# EAGLE design SWITCHER V2 (EAGLE 6.6.0)
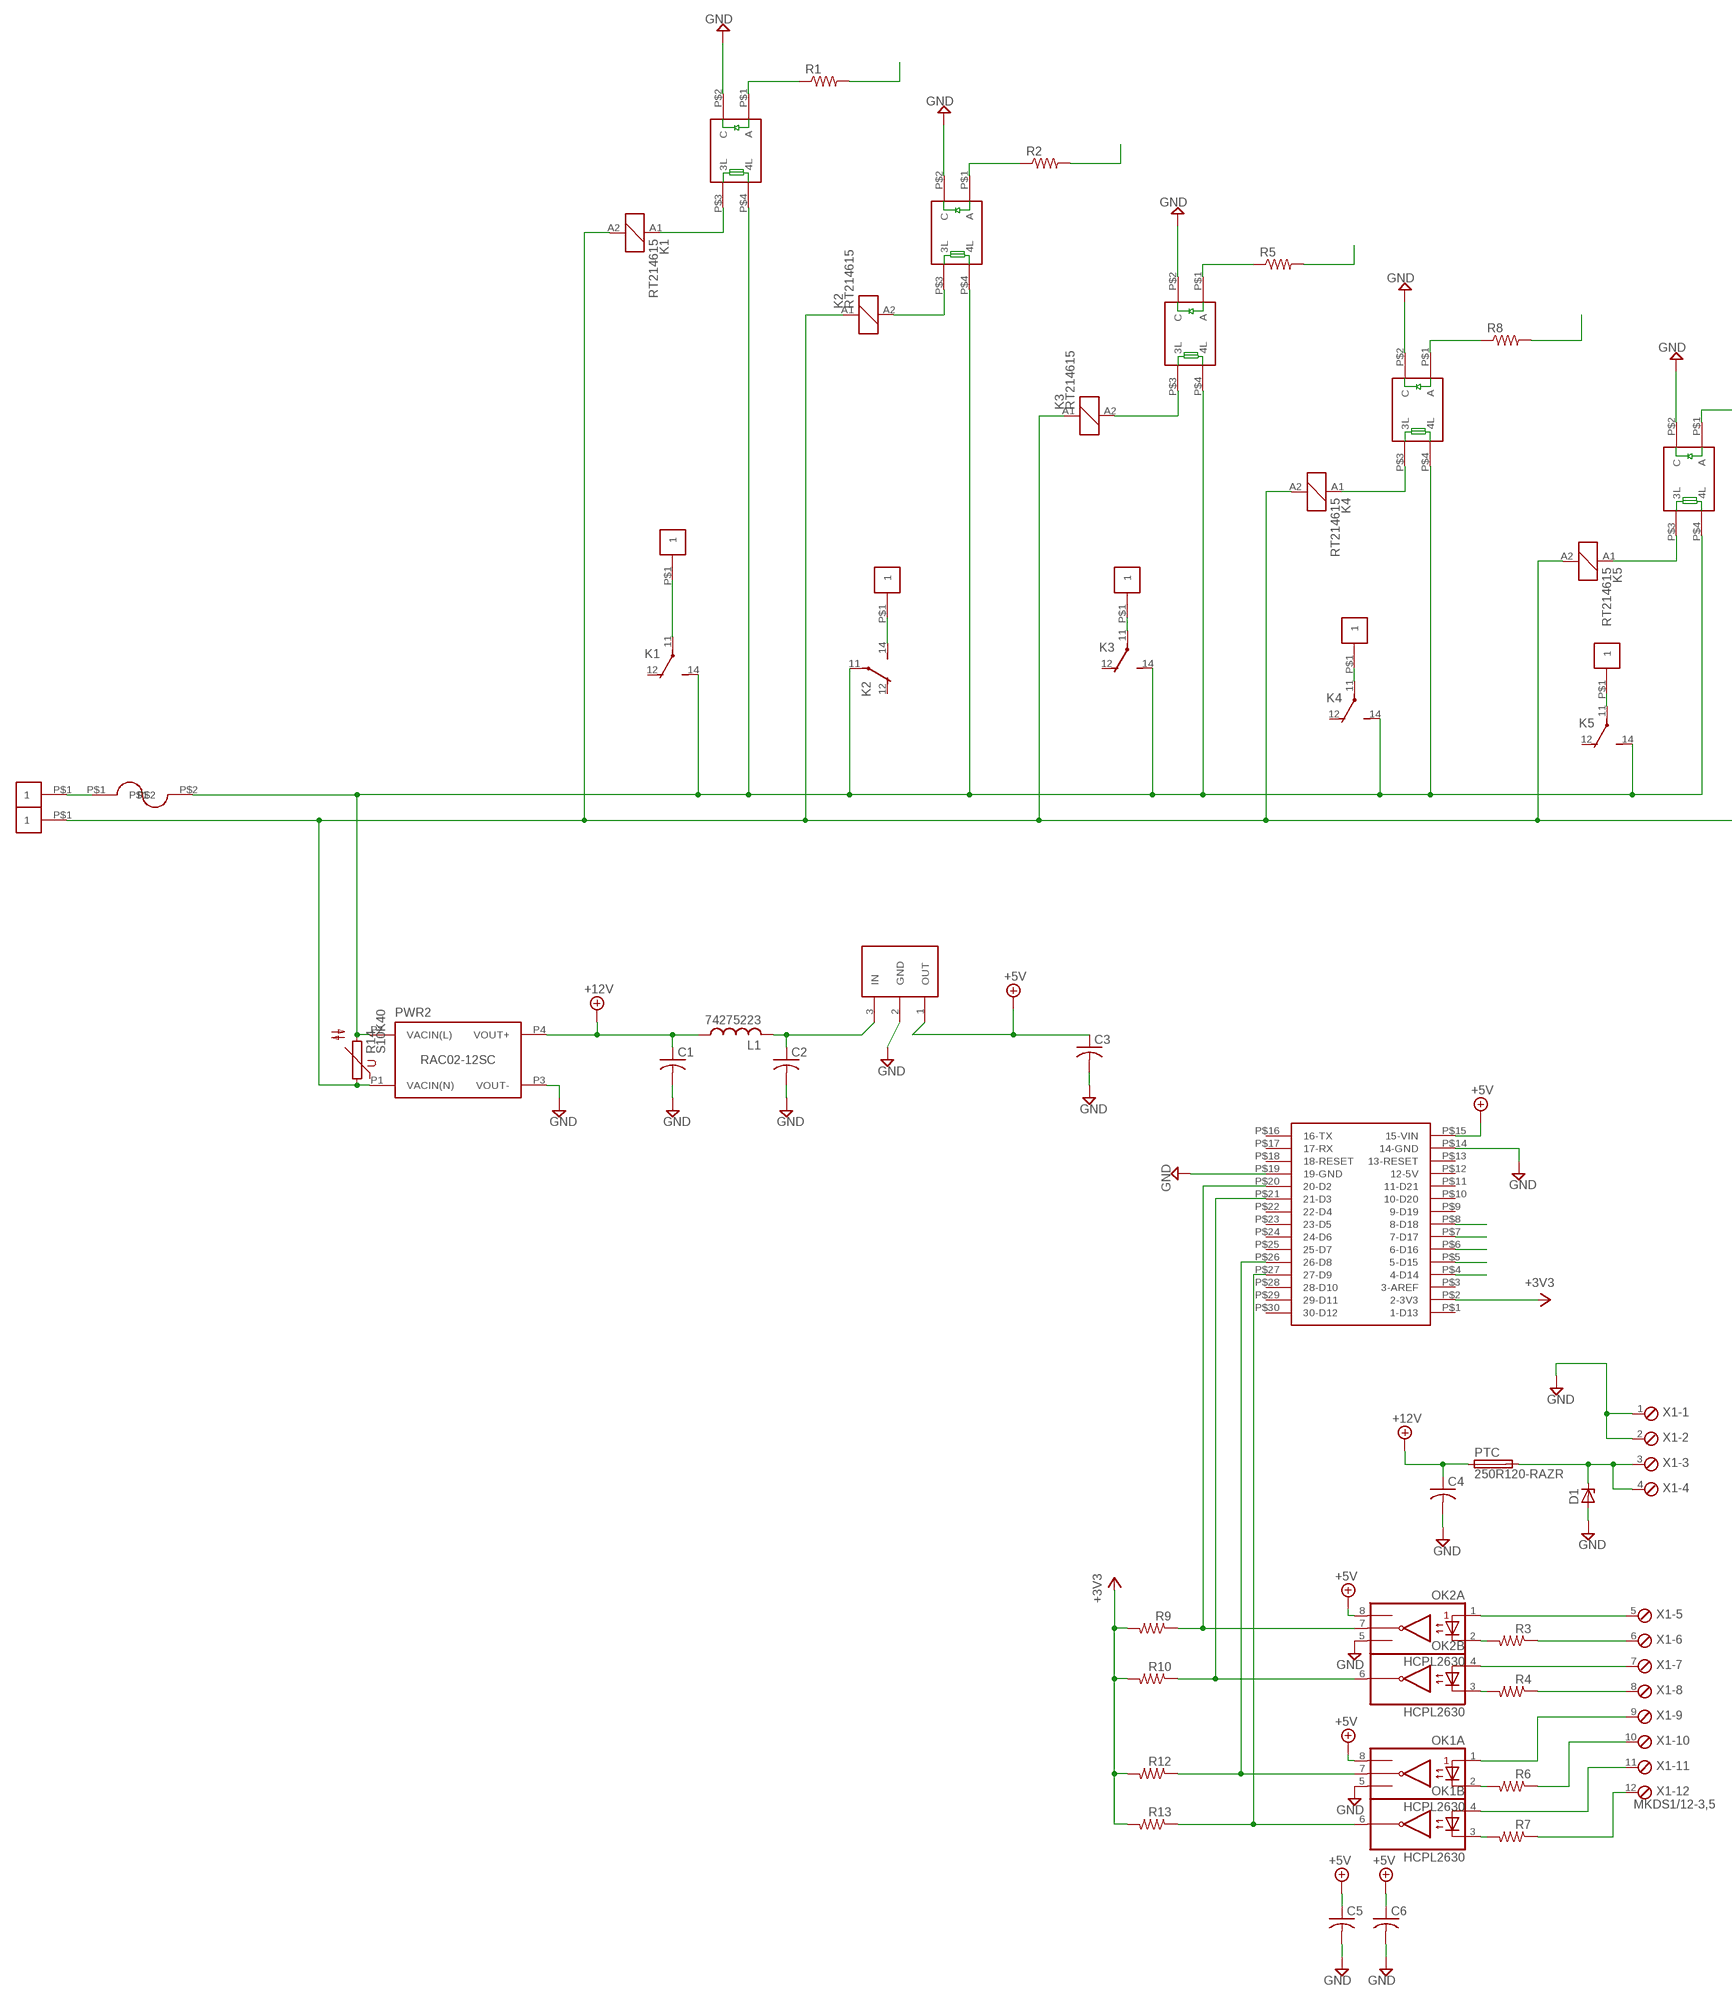
[diagram p0: schematic, sheet 1, part 1 of 2]
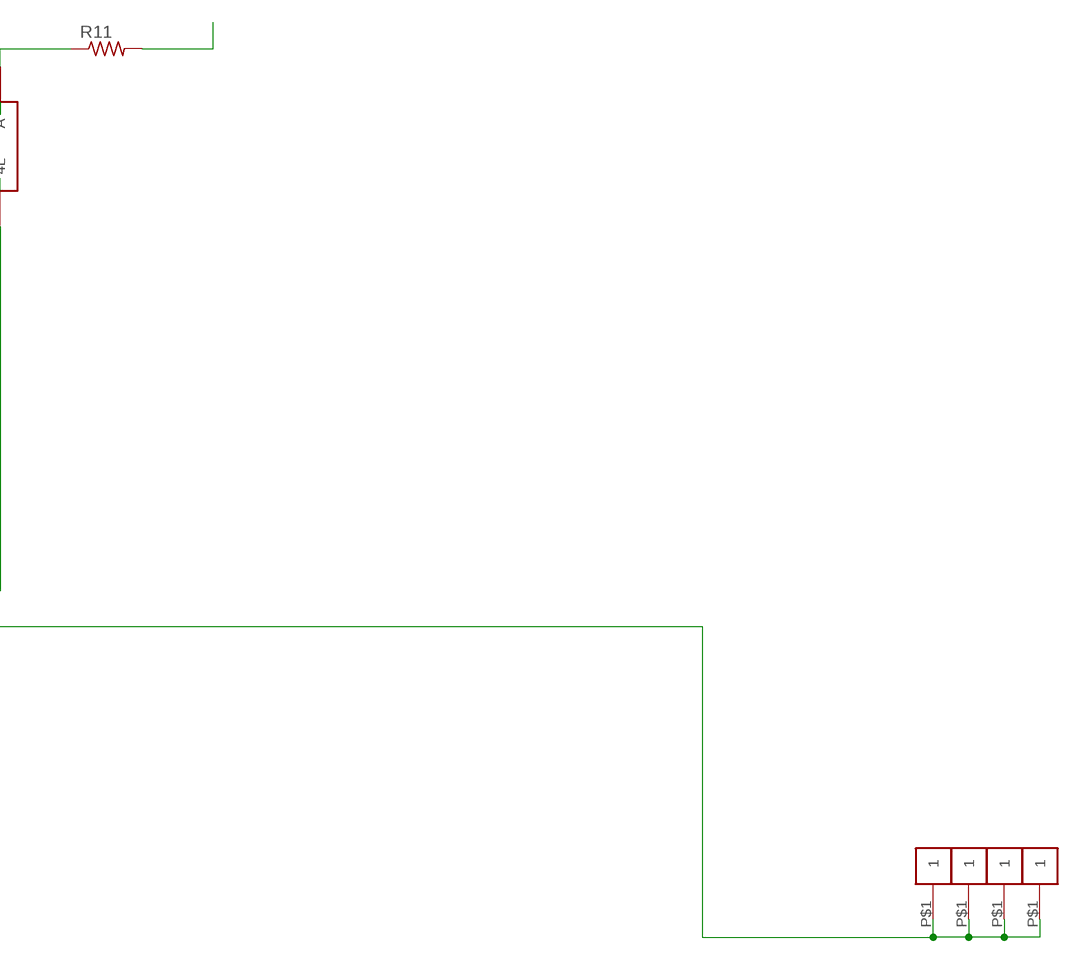
[diagram p1: schematic, sheet 1, part 2 of 2]

## Parts
C1  C-US025-024X044  [C025-024X044]
C2  C-US025-024X044  [C025-024X044]
C3  C-US025-024X044  [C025-024X044]
C4  C-US050-025X075  [C050-025X075]
C5  C-US025-024X044  [C025-024X044]
C6  C-US025-024X044  [C025-024X044]
D1  ZENER-DIODEZD-5  [ZDIO-5]
K1  RT214615  [RT-C/O12A5]
K2  RT214615  [RT-C/O12A5]
K3  RT214615  [RT-C/O12A5]
K4  RT214615  [RT-C/O12A5]
K5  RT214615  [RT-C/O12A5]
L1  74275223  L-US6000-XXX-RC  [6000-XXXX-RC]
OK1  HCPL2630  [DIL08]
OK2  HCPL2630  [DIL08]
PTC  250R120-RAZR  TE5  [TE5]
PWR2  RAC02-12SC  [LOW_PROFILE_POWER_MODULE]
R1  R-US_0204/7  [0204/7]
R2  R-US_0204/7  [0204/7]
R3  R-US_0204/7  [0204/7]
R4  R-US_0204/7  [0204/7]
R5  R-US_0204/7  [0204/7]
R6  R-US_0204/7  [0204/7]
R7  R-US_0204/7  [0204/7]
R8  R-US_0204/7  [0204/7]
R9  R-US_0204/7  [0204/7]
R10  R-US_0204/7  [0204/7]
R11  R-US_0204/7  [0204/7]
R12  R-US_0204/7  [0204/7]
R13  R-US_0204/7  [0204/7]
R14  S10K40  [S10K40]
U$1  CPC1393  [CPC1393G]
U$2  089RIVET  [KEYSTONE33]
U$3  T9-818  [T9-818]
U$4  CPC1393  [CPC1393G]
U$5  CPC1393  [CPC1393G]
U$6  CPC1393  [CPC1393G]
U$7  CPC1393  [CPC1393G]
U$8  TL750  [TO92-OVAL]
U$9  ARDUINO-NANO-EVERY  [ARDUINO-NANO-EVERY]
U$11  089RIVET  [KEYSTONE33]
U$12  089RIVET  [KEYSTONE33]
U$13  089RIVET  [KEYSTONE33]
U$14  089RIVET  [KEYSTONE33]
U$21  089RIVET  [KEYSTONE33]
U$22  089RIVET  [KEYSTONE33]
U$25  089RIVET  [KEYSTONE33]
U$26  089RIVET  [KEYSTONE33]
U$27  089RIVET  [KEYSTONE33]
U$28  089RIVET  [KEYSTONE33]
X1  MKDS1/12-3,5  [12POL350]

## Nets
+3V3: R9.2 R10.2 R12.2 R13.2 U$9.P$2(2-3V3)
+5V: C3.1 C5.1 C6.1 OK1.8(A:VCC) OK2.8(A:VCC) U$8.1(OUT) U$9.P$15(15-VIN)
+12V: C1.1 C4.1 L1.1 PTC.1 PWR2.P4(VOUT+)
BREAKER-L: K1.14(2:S) K2.11(2:P) K3.14(2:S) K4.14(2:S) K5.14(2:S) PWR2.P2(VACIN(L)) R14.2 U$1.P$4(4L) U$3.P$2 U$4.P$4(4L) U$5.P$4(4L) U$6.P$4(4L) U$7.P$4(4L)
D14: R1.2 U$9.P$4(4-D14)
D15: R2.2 U$9.P$5(5-D15)
D16: R11.2 U$9.P$6(6-D16)
D17: R8.2 U$9.P$7(7-D17)
D18: R5.2 U$9.P$8(8-D18)
GND: C1.2 C2.2 C3.2 C4.2 C5.2 C6.2 D1.A OK1.5(A:GND) OK2.5(A:GND) PWR2.P3(VOUT-) U$1.P$2(C) U$4.P$2(C) U$5.P$2(C) U$6.P$2(C) U$7.P$2(C) U$8.2(GND) U$9.P$14(14-GND) U$9.P$19(19-GND) X1.1 X1.2
N$6: U$2.P$1 U$3.P$1
N$12: C2.1 L1.2 U$8.3(IN)
N$13: K2.14(2:S) U$25.P$1
N$14: OK1.3(B:C2) R7.2
N$15: OK2.7(A:VO1) R9.1 U$9.P$20(20-D2)
N$16: K2.A2 U$4.P$3(3L)
N$17: R2.1 U$4.P$1(A)
N$18: OK2.6(B:VO2) R10.1 U$9.P$21(21-D3)
N$20: K1.11(2:P) U$21.P$1
N$21: OK2.1(A:A1) X1.5
N$22: K1.A1 U$1.P$3(3L)
N$23: R1.1 U$1.P$1(A)
N$24: K5.11(2:P) U$28.P$1
N$25: R3.1 X1.6
N$26: K4.11(2:P) U$27.P$1
N$28: OK1.2(A:C1) R6.2
N$32: K3.11(2:P) U$26.P$1
N$33: OK2.3(B:C2) R4.2
N$34: OK2.2(A:C1) R3.2
N$35: OK2.4(B:A2) X1.7
N$36: K3.A2 U$5.P$3(3L)
N$37: R5.1 U$5.P$1(A)
N$38: R4.1 X1.8
N$44: OK1.7(A:VO1) R12.1 U$9.P$26(26-D8)
N$45: D1.C PTC.2 X1.3 X1.4
N$46: OK1.6(B:VO2) R13.1 U$9.P$27(27-D9)
N$47: OK1.1(A:A1) X1.9
N$48: K4.A1 U$6.P$3(3L)
N$49: R8.1 U$6.P$1(A)
N$50: R6.1 X1.10
N$56: OK1.4(B:A2) X1.11
N$57: R7.1 X1.12
N$60: K5.A1 U$7.P$3(3L)
N$61: R11.1 U$7.P$1(A)
N$68: K1.A2 K2.A1 K3.A1 K4.A2 K5.A2 PWR2.P1(VACIN(N)) R14.1 U$11.P$1 U$12.P$1 U$13.P$1 U$14.P$1 U$22.P$1
Unconnected: K1.12(2:O) K2.12(2:O) K3.12(2:O) K4.12(2:O) K5.12(2:O) U$9.P$1(1-D13) U$9.P$3(3-AREF) U$9.P$9(9-D19) U$9.P$10(10-D20) U$9.P$11(11-D21) U$9.P$12(12-5V) U$9.P$13(13-RESET) U$9.P$16(16-TX) U$9.P$17(17-RX) U$9.P$18(18-RESET) U$9.P$22(22-D4) U$9.P$23(23-D5) U$9.P$24(24-D6) U$9.P$25(25-D7) U$9.P$28(28-D10) U$9.P$29(29-D11) U$9.P$30(30-D12)

## Library data of the parts
C1-C6 = rcl:C-US: CAPACITOR, American symbol
D1 = diode:ZENER-DIODE: Z-Diode
K1-K5 = relay:RT?1*: Power PCB Relayl SCHRACK 1 pole 12 / 16 A, DC- or AC-coi Source: http://www.schrack.com/.. 5819.pdf; MF: TYCO ELECTRONICS; MPN: RT214615; OC_FARNELL: unknown; OC_NEWARK: 93B6578
L1 = rcl:L-US: INDUCTOR, American symbol
OK1 OK2 = optocoupler:HCPL2630: HEWLETT PACKARD OPTO COUPLER; MF: AGILENT TECHNOLOGIES; MPN: HCPL-2630-000E; OC_FARNELL: 9994904; OC_NEWARK: 88H7813
PTC = fuse:TE5: FUSE Wickmann; OC_FARNELL: unknown; OC_NEWARK: unknown
PWR2 = recom-powerline-acdc-converters:RAC*SC: RECOM POWERLINE AC/DC-Converter (RAC01-SC and RAC02-SC series) The RAC01-SC and RAC02-SC series are ultra-compact universal input AC/DC power modules for PCB mounting. They feature high efficiency, low standby power, high operating temperature, soft start and short-circuit protection as well as a built-in EMC Class B filter. Output voltages range from 3.3VDC to 24VDC. Datasheet <http://www.recom-power.com/pdf/Powerline-AC-DC/RAC01_02-SC.pdf>; INPUT_RANGE: 80 - 277 (VAC); MAX_CAPACITIVE_LOAD: 180uF; OUTPUT_CURRENT: 167mA; OUTPUT_VOLTAGE: 12v
R1-R13 = rcl:R-US_: RESISTOR, American symbol
R14 = varistor:S10K40: VARISTOR
U$1 U$4-U$7 = NEMA5-15_SWITCH:CPC1393
U$2 U$11-U$14 U$21 U$22 U$25-U$28 = Dean-2019:089RIVET
U$3 = NEMA5-15_SWITCH:T9-818
U$8 = Dean:TL750
U$9 = dean-arduino-nano-every:ARDUINO-NANO-EVERY
X1 = con-phoenix-350 b:MKDS1/12-3,5: MKDS 1/12-3,5 - Order No. 1751345 Pitch: 3,5mm Number of terminals: 12 Rated Voltage: 160V Maximum load current/ cross section: 12A/1.5mm2-AWG16 Housing Interlocking: none Color: Green

## Board
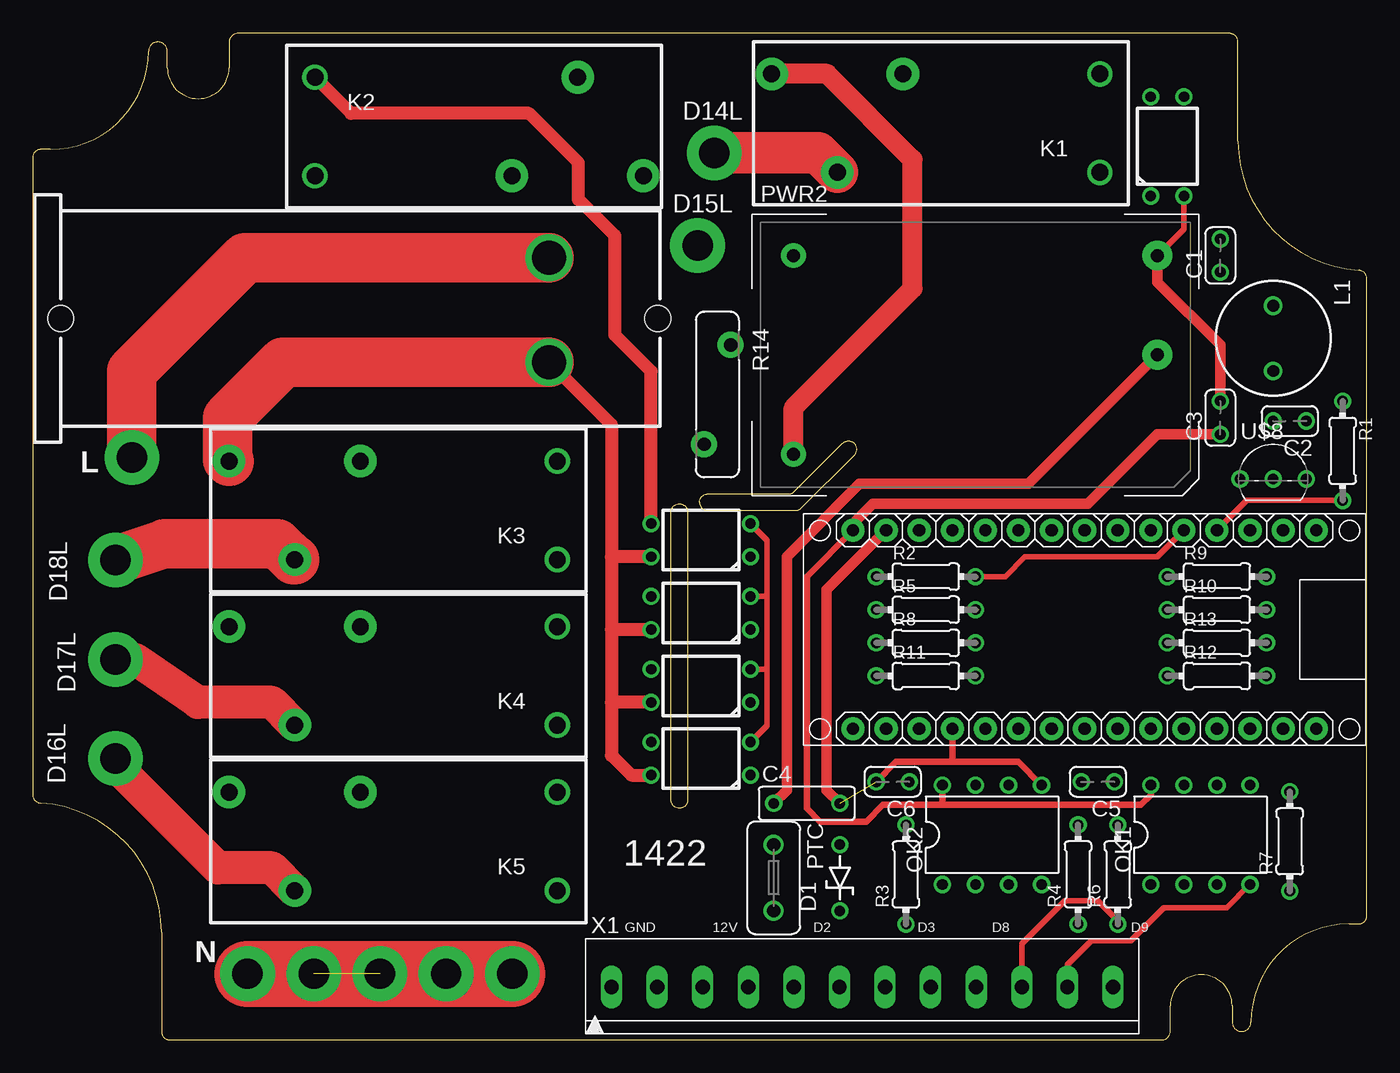
[diagram p2: board, top side]
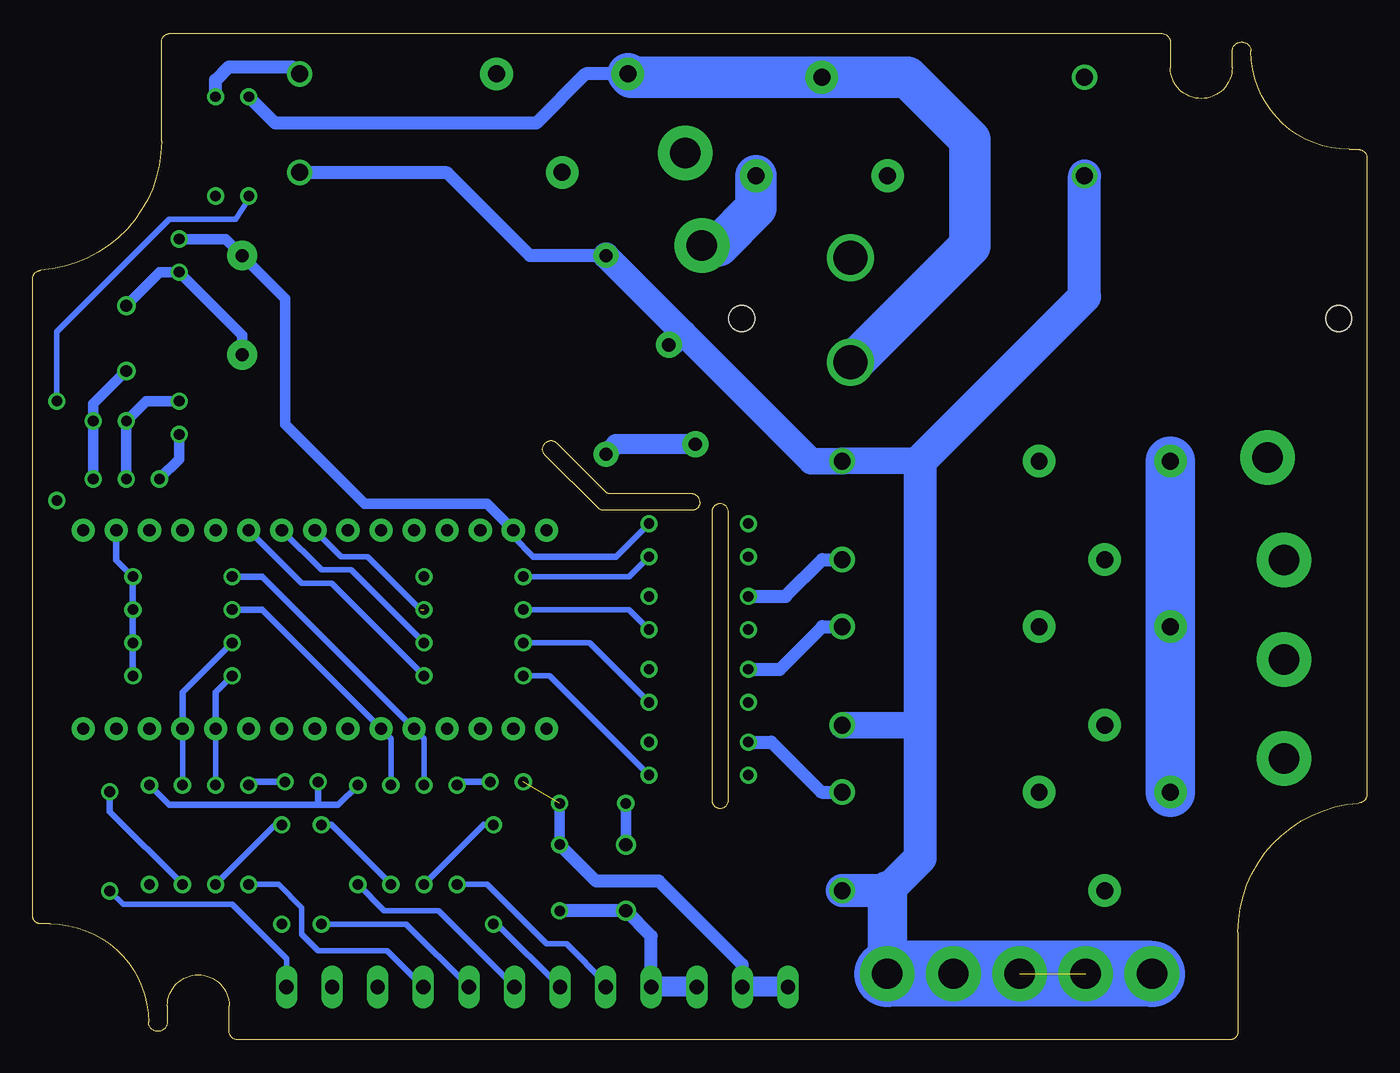
[diagram p3: board, bottom side, seen from below]

Size 102.45 x 77.25 mm. Coordinates in mm from the lower left corner, seen from the top.
Outline: 1.37,68.35 arc90 8.9,75.87 arc-180 10.35,75.87 10.35,74.62 arc180 15.1,74.62 15.1,76.59 arc-90 15.76,77.25 91.89,77.25 arc-90 92.55,76.59 92.55,68.97 arc86 101.83,59.07 arc-86 102.45,58.41 102.45,9.56 arc-90 101.79,8.9 101.07,8.9 arc90 93.55,1.37 arc-180 92.1,1.37 92.1,2.62 arc180 87.35,2.62 87.35,0.66 arc-90 86.69,0 10.56,0 arc-90 9.9,0.66 9.9,8.27 arc86 0.62,18.18 arc-86 0,18.84 0,67.69 arc-90 0.66,68.35 1.37,68.35
Outline: 49.66,41.15 arc-90 50.29,40.51 50.29,18.41 arc-90 49.66,17.78 arc-90 49.02,18.41 49.02,40.51 arc-90 49.66,41.15
Outline: 51.21,41.27 arc90 51.84,40.64 58.59,40.64 arc45 59.04,40.83 63.09,44.88 arc91 63.09,45.79 63.09,45.79 arc89 62.19,45.78 58.5,42.1 arc-45 58.05,41.91 51.84,41.91 arc90 51.21,41.27
Copper layers (1*16): Top 0.035mm / dielectric 1.5mm / Bottom 0.035mm
Design rules "default *": minimum track width 10mil, minimum drill 24mil, track to track 8mil, track to pad 8mil, pad to pad 8mil, via to via 8mil, smd to smd 8mil, copper to edge 10mil, drill to drill 8mil, minimum pad ring 10mil, minimum via ring 8mil, stop-mask expansion 4mil, vias tented up to drill 25mil, thermal gap 10mil

### Footprints (pad centres in the part's own frame; a part is rotated, then mirrored left to right if it is on the bottom)
C025-024X044 = drill 0.813: 1 -1.27,0; 2 1.27,0
C050-025X075 = drill 0.813: 1 -2.54,0; 2 2.54,0
ZDIO-5 = drill 0.813: A 2.54,0; C -2.54,0
RT-C/O12A5 = drill 1.3 pad 2.5: 11 7.56,3.78; 12 2.52,-3.78; 14 12.6,-3.78 | drill 1.3: A1 -12.6,-3.78; A2 -12.6,3.78
6000-XXXX-RC = drill 0.9 pad 1.422: 1 -2.5,0; 2 2.5,0
DIL08 = drill 0.813: 1 -3.81,-3.81; 2 -1.27,-3.81; 3 1.27,-3.81; 4 3.81,-3.81; 5 3.81,3.81; 6 1.27,3.81; 7 -1.27,3.81; 8 -3.81,3.81
TE5 = drill 1.016: 1 -2.54,0; 2 2.54,0
LOW_PROFILE_POWER_MODULE = drill 1 pad 1.905: P1 -12.7,7.62; P2 -12.7,-7.62 | drill 1 pad 2.286: P3 15.24,7.62; P4 15.24,0
0204/7 = drill 0.813: 1 -3.81,0; 2 3.81,0
S10K40 = drill 1.016 pad 2: 1 -1.016,-3.81; 2 1.016,3.81
CPC1393G = drill 0.8: P$1 0,0; P$2 0,-2.54; P$3 7.62,-2.54; P$4 7.62,0
KEYSTONE33 = drill 2.337 pad 4.191: P$1 0,0
T9-818 = drill 2.6: P$1 37.5,4.65; P$2 37.5,-3.35 | hole 2: 0,0; 45.85,0
TO92-OVAL = drill 0.813: 1 -2.54,0; 2 0,0; 3 2.54,0
ARDUINO-NANO-EVERY = drill 0.94 pad 1.778: P$1 3.81,1.27; P$2 6.35,1.27; P$3 8.89,1.27; P$4 11.43,1.27; P$5 13.97,1.27; P$6 16.51,1.27; P$7 19.05,1.27; P$8 21.59,1.27; P$9 24.13,1.27; P$10 26.67,1.27; P$11 29.21,1.27; P$12 31.75,1.27; P$13 34.29,1.27; P$14 36.83,1.27; P$15 39.37,1.27; P$16 39.37,16.51; P$17 36.83,16.51; P$18 34.29,16.51; P$19 31.75,16.51; P$20 29.21,16.51; P$21 26.67,16.51; P$22 24.13,16.51; P$23 21.59,16.51; P$24 19.05,16.51; P$25 16.51,16.51; P$26 13.97,16.51; P$27 11.43,16.51; P$28 8.89,16.51; P$29 6.35,16.51; P$30 3.81,16.51
12POL350 = drill 1.1 long: 1 0,0; 2 3.5,0; 3 7,0; 4 10.5,0; 5 14,0; 6 17.5,0; 7 21,0; 8 24.5,0; 9 28,0; 10 31.5,0; 11 35,0; 12 38.5,0

### Placement (x,y rotation side)
C1  91.19,60.2 90 top
C2  96.52,47.5 180 top
C3  91.19,47.75 90 top
C4  59.44,18.16 0 top
C5  81.79,19.81 180 top
C6  66.04,19.81 180 top
D1  61.98,12.45 90 top
K1  69.34,70.36 180 top
K2  34.29,70.1 0 top
K3  27.69,40.64 180 top
K4  27.69,27.94 180 top
K5  27.69,15.24 180 top
L1  95.25,53.85 270 top
OK1  89.66,15.75 0 top
OK2  73.66,15.75 0 top
PTC  56.9,12.45 270 top
PWR2  71.12,52.58 0 top
R1  100.58,45.21 270 top
R2  68.58,35.56 0 top
R3  67.06,12.7 90 top
R4  80.26,12.7 90 top
R5  68.58,33.02 0 top
R6  83.31,12.7 90 top
R7  96.52,15.24 90 top
R8  68.58,30.48 0 top
R9  90.93,35.56 0 top
R10  90.93,33.02 0 top
R11  68.58,27.94 0 top
R12  90.93,27.94 0 top
R13  90.93,30.48 0 top
R14  52.58,49.53 180 top
U$1  85.85,64.77 90 top
U$2  7.62,44.7 90 top
U$3  2.16,55.37 0 top
U$4  55.12,37.08 180 top
U$5  55.12,31.5 180 top
U$6  55.12,25.91 180 top
U$7  55.12,20.32 180 top
U$8  95.25,43.05 0 top
U$9  102.36,40.39 180 top
U$11  16.51,5.08 90 top
U$12  21.59,5.08 90 top
U$13  26.67,5.08 90 top
U$14  31.75,5.08 90 top
U$21  52.32,68.07 90 top
U$22  36.83,5.08 90 top
U$25  51.05,60.96 0 top
U$26  6.35,36.83 0 top
U$27  6.35,29.21 0 top
U$28  6.35,21.59 0 top
X1  44.45,4.06 0 top

### Tracks (layer width: path | path; a pad name or v marks a point on that pad's centre or on a via)
+3V3
  Bottom 0.508: R13.2 R12.2 R10.2 R9.2 96.01,36.83 U$9.P$2
+5V
  Top 0.508: U$9.P$15 59.44,35.56 59.44,17.78 60.45,16.76 64.01,16.76 65.28,18.03 69.85,18.03 | 69.85,18.03 85.09,18.03 85.85,18.8 OK1.8 | OK2.8 69.85,18.03
  Top 0.813: U$9.P$15 62.99,39.62 64.52,41.15 81.03,41.15 86.36,46.48 C3.1
  Bottom 0.508: C5.1 85.6,19.81 OK1.8 | C6.1 69.6,19.81 OK2.8
  Bottom 0.813: U$8.1 91.19,44.58 C3.1
+12V
  Top 0.813: C4.1 57.91,19.18 57.91,37.08 63.5,42.67 76.45,42.67 PWR2.P4
  Bottom 0.813: PTC.1 C4.1 | L1.1 92.67,58.93 C1.1 86.36,54.1 PWR2.P4
BREAKER-L
  Top 1.016: 44.45,37.08 44.45,47.23 U$3.P$2 | 44.45,37.08 44.45,31.5 | 44.45,31.5 44.45,25.91 | 44.45,25.91 44.45,21.84 45.97,20.32 U$7.P$4 | U$6.P$4 44.45,25.91 | U$5.P$4 44.45,31.5 | U$4.P$4 44.45,37.08
  Top 1.524: PWR2.P2 58.42,48.51 67.56,57.66 67.56,67.56 60.99,74.14 K1.14
  Top 3.81: K3.14 14.99,44.52 14.99,47.75 19.26,52.02 U$3.P$2
  Bottom 1.016: K1.14 59.97,74.14 63.75,70.36 83.82,70.36 U$1.P$4
  Bottom 1.524: R14.2 57.66,45.72 PWR2.P2
  Bottom 3.175: K1.14 56.49,73.88 K2.11 35.28,73.88 30.48,69.09 30.48,60.96 39.42,52.02 U$3.P$2
  Bottom 3.81: K3.14 K4.14 K5.14
D14
  Top 0.406: U$9.P$4 93.22,41.4 R1.2
D15
  Top 0.406: U$9.P$5 86.36,37.08 76.2,37.08 74.68,35.56 R2.2
D16
  Bottom 0.406: U$9.P$6 81.79,35.05 79.5,35.05 R11.2
D17
  Bottom 0.406: U$9.P$7 80.26,36.07 77.98,36.07 R8.2
D18  (1 unrouted)
  Bottom 0.406: U$9.P$8 78.74,37.08 76.71,37.08 72.64,33.02
GND  (1 unrouted)
  Top 0.406: U$7.P$2 56.39,24.13 56.39,28.45 | 56.39,28.45 56.39,34.04 | 56.39,34.04 56.39,38.35 U$4.P$2 | U$6.P$2 56.39,28.45 | U$5.P$2 56.39,34.04 | U$1.P$2 88.39,62.23 PWR2.P3
  Top 0.508: C6.2 66.29,21.34 70.61,21.34 | 70.61,21.34 75.69,21.34 OK2.5 | U$9.P$19 70.61,21.34
  Top 0.813: U$9.P$14 60.96,34.54 60.96,19.18 C4.2 | C3.2 91.19,53.34 86.36,58.17 PWR2.P3
  Bottom 0.508: U$4.P$2 55.12,39.37 | U$9.P$14 65.53,38.61 64.01,37.08 57.66,37.08 U$4.P$2 | 55.37,39.62 U$4.P$2 | OK2.5 78.99,18.03 80.52,18.03 | 80.52,18.03 91.95,18.03 OK1.5 | C5.2 80.52,18.03
  Bottom 0.762: PWR2.P3 86.36,59.94
  Bottom 0.813: U$9.P$14 67.56,41.15 76.96,41.15 83.06,47.24 83.06,56.9 PWR2.P3 87.63,61.47 C1.2 | U$8.2 C2.2 93.73,49.02 C3.2 | D1.A C4.2
  Bottom 1.016: X1.2 47.95,5.79 54.36,12.19 59.18,12.19 D1.A
  Bottom 1.524: X1.1 X1.2
N$6
  Top 3.81: U$3.P$1 16.33,60.02 7.62,51.31 U$2.P$1
N$12
  Bottom 0.813: U$8.3 C2.1 97.79,48.81 L1.2
N$13
  Bottom 3.175: K2.14 46.89,63.85 49.78,60.96 U$25.P$1
N$14
  Bottom 0.508: R7.2 96.52,17.53 OK1.3
N$15
  Bottom 0.406: OK2.7 72.39,23.11 U$9.P$20
  Bottom 0.508: R9.1 84.84,35.56 U$9.P$20
N$16
  Top 1.016: U$4.P$3 47.5,51.31 44.7,54.1 44.7,61.72 41.91,64.52 41.91,67.31 38.1,71.12 24.45,71.12 K2.A2
N$17
  Bottom 0.406: U$4.P$1 56.64,35.56 R2.1
N$18
  Bottom 0.406: OK2.6 74.93,23.11 75.31,23.5 U$9.P$21
  Bottom 0.508: R10.1 84.84,33.02 75.31,23.5
N$20
  Top 3.175: K1.11 60.29,68.07 U$21.P$1
N$21
  Bottom 0.406: X1.5 58.45,4.35 61.47,7.37 62.99,7.37 67.56,11.94 OK2.1
N$22
  Bottom 1.016: U$1.P$3 88.39,73.66 87.38,74.68 82.48,74.68 K1.A1
N$23
  Bottom 0.406: R1.1 100.58,54.36 91.95,62.99 86.87,62.99 85.85,64.52 U$1.P$1
N$24
  Top 2.54: K5.11 18.38,13.21 14.22,13.21 6.35,21.08 U$28.P$1
N$25
  Bottom 0.406: R3.1 66.78,8.89 X1.6
N$26
  Top 2.54: U$27.P$1 7.87,29.21 12.7,25.91 18.38,25.91 K4.11
N$28
  Bottom 0.508: R6.2 83.82,16.51 OK1.2
N$32
  Top 3.81: K3.11 20.04,36.86 18.8,38.1 10.16,38.1 U$26.P$1
N$33
  Bottom 0.508: OK2.3 79.5,16.51 R4.2
N$34
  Bottom 0.508: OK2.2 67.82,16.51 R3.2
N$35
  Bottom 0.406: X1.7 71.29,9.91 75.44,9.91 OK2.4
N$36
  Bottom 1.016: U$5.P$3 44.63,34.04 41.81,36.86 K3.A2
N$37
  Bottom 0.406: U$5.P$1 56.64,33.02 R5.1
N$38
  Bottom 0.406: X1.8 73.78,8.89 R4.1
N$44
  Bottom 0.406: U$9.P$26 OK1.7
  Bottom 0.508: R12.1 88.39,26.67 U$9.P$26
N$45
  Bottom 1.016: X1.4 54.95,7.96 PTC.2 D1.C
  Bottom 1.524: X1.3 X1.4
N$46
  Bottom 0.406: U$9.P$27 OK1.6
  Bottom 0.508: R13.1 90.93,26.67 U$9.P$27
N$47
  Bottom 0.406: X1.9 75.24,6.86 80.52,6.86 81.79,8.13 81.79,10.16 83.57,11.94 OK1.1
N$48
  Bottom 1.016: U$6.P$3 45.08,28.45 41.81,31.72 K4.A1
N$49
  Bottom 0.406: U$6.P$1 59.69,30.48 R8.1
N$50
  Top 0.406: R6.1 83.31,9.14 81.79,10.67 79.25,10.67 75.95,7.37 X1.10
N$56
  Top 0.406: OK1.4 91.69,10.16 86.87,10.16 84.33,7.62 81.28,7.62 79.45,5.79 X1.11
N$57
  Bottom 0.406: R7.1 95.5,10.41 87.12,10.41 82.95,6.24 X1.12
N$60
  Bottom 1.016: U$7.P$3 45.72,22.86 41.88,19.02 K5.A1 40.32,19.05
N$61
  Bottom 0.406: U$7.P$1 62.74,27.94 R11.1
N$68  (1 unrouted)
  Top 5.08: U$11.P$1 U$13.P$1 U$14.P$1 U$22.P$1
  Bottom 1.016: K1.A2 81.91,66.55 70.61,66.55 64.26,60.2 PWR2.P1
  Bottom 2.032: K4.A2 34.32,24.16 | 34.29,44.45 40.29,44.45 K3.A1 42.64,44.42 52.45,54.23 | 52.45,54.23 PWR2.P1 | R14.1 52.45,54.23
  Bottom 2.54: 34.29,24.13 34.29,13.97 36.8,11.46 K5.A2 | 34.29,24.13 34.29,44.45 21.69,57.05 K2.A1 | 34.32,24.16 34.29,24.13
  Bottom 3.048: 36.8,11.46 36.8,5.08 U$22.P$1
  Bottom 5.08: U$11.P$1 U$22.P$1

### Text on the board
tPlace: D14L | D15L | L | D18L | D17L | D16L | 1422 | GND | 12V | D2 | D3 | D8 | D9 | N